# EAGLE design Mabee_Serial WiFi V1.1 (EAGLE 6.1)
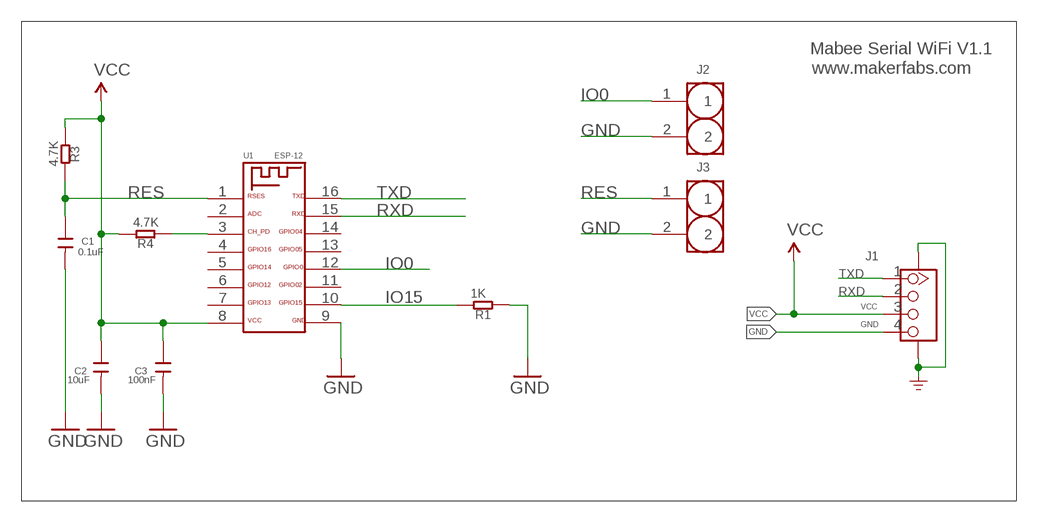
[diagram p0: schematic, sheet 1]

## Parts
C1  0.1uF  C-0603  [C0603]
C2  10uF  C-0603  [C0603]
C3  100nF  C-0603  [C0603]
J1  GROVE-CONNECTOR-SMD'90D'  [HW4-SMD-2.0-90D]
J2  HEADER-2P-65/35MIL  [2P-2.54-65/35MIL]
J3  HEADER-2P-65/35MIL  [2P-2.54-65/35MIL]
R1  1K  R-0603  [0603]
R3  4.7K  R-0603  [0603]
R4  4.7K  R-0603  [0603]
U1  ESP-12  [ESP-12]

## Nets
EN: R4.1 U1.3
GND: C1.2 C2.2 C3.2 J1.4 J1.SS1 J1.SS2 J2.2 J3.2 R1.1 U1.9
IO0: J2.1 U1.12
IO15: R1.2 U1.10
RES: C1.1 J3.1 R3.2 U1.1
RXD: J1.2 U1.15
TXD: J1.1 U1.16
VCC: C2.1 C3.1 J1.3 R3.1 R4.2 U1.8
Unconnected: U1.2 U1.4 U1.5 U1.6 U1.7 U1.11 U1.13 U1.14

## Notes on the sheet
- Mabee Serial WiFi V1.1
- www.makerfabs.com

## Library data of the parts
C1-C3 = Discrete:C*: Ceramic Capacitors
J1 = Connector-new:GROVE-CONNECTOR-SMD: 4P-SMD-2.0:320110030;4P-SMD-2.0-90D:320110032
J2 J3 = Connector:HEADER-2P
R1 R3 R4 = Discrete:R*
U1 = Discrete:ESP-12

## Net classes
0 default: width 0.203 mm, drill 0.305 mm, clearance 0.152 mm
1 vbat: width 0.254 mm, drill 0.305 mm, clearance 0.152 mm

## Board
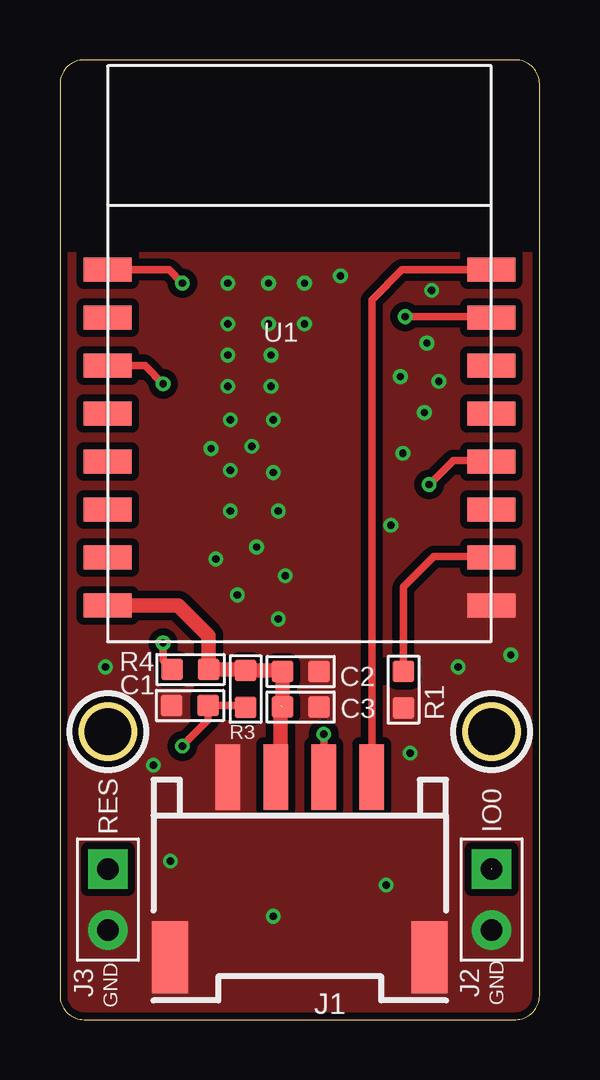
[diagram p1: board, top side]
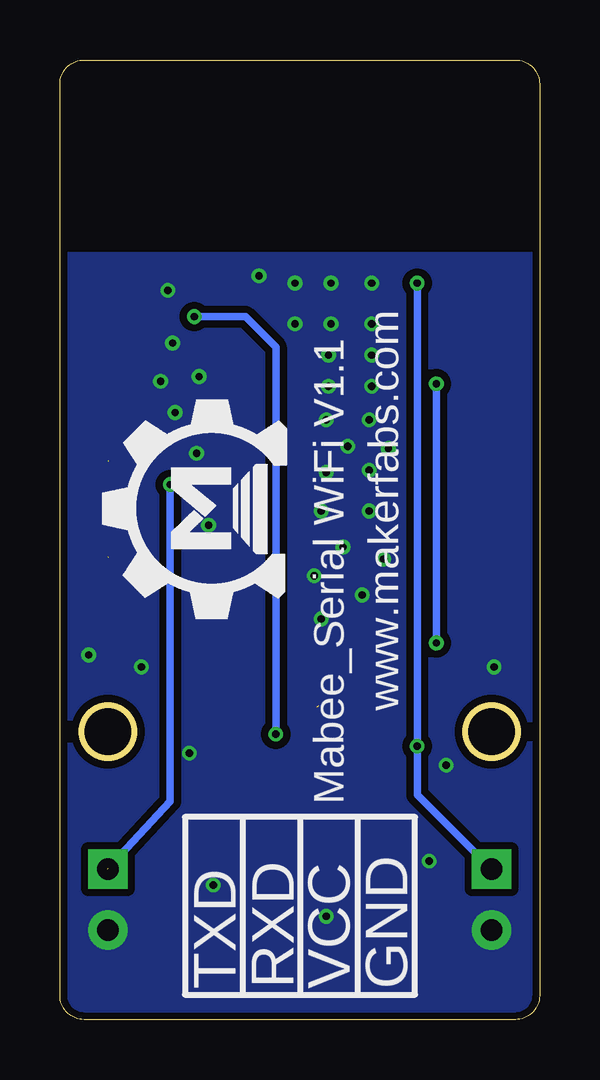
[diagram p2: board, bottom side, seen from below]

Size 20 x 40 mm. Coordinates in mm from the lower left corner, seen from the top.
Outline: 19,40 1,40 arc90 0,39 0,1 arc90 1,0 19,0 arc90 20,1 20,39 arc90 19,40
Outline: circle at 2,12 radius 1.1
Outline: circle at 18,12 radius 1.1
Copper layers (1*16): Top 0.035mm / dielectric 1.5mm / Bottom 0.035mm
Design rules: minimum track width 6mil, minimum drill 12mil, track to track 6mil, track to pad 6mil, pad to pad 6mil, via to via 6mil, smd to smd 0mil, copper to edge 10mil, drill to drill 10mil, minimum pad ring 10mil, minimum via ring 6mil, stop-mask expansion 2mil, vias tented up to drill 100mil, thermal gap 0mil
tRestrict: area -1.2,32.3 to 23,40.4
bRestrict: area -1.2,32.3 to 23,40.4

### Footprints (pad centres in the part's own frame; a part is rotated, then mirrored left to right if it is on the bottom)
C0603 = smd 0.889 x 0.889: 1 -0.762,0; 2 0.762,0
HW4-SMD-2.0-90D = smd 1.01 x 2.74: 1 -3,-0.1; 2 -1,-0.1; 3 1,-0.1; 4 3,-0.1 | smd 1.5 x 3: SS1 -5.4,7.4; SS2 5.4,7.4
2P-2.54-65/35MIL = drill 0.889 pad 1.651 square: 1 0,1.27 | drill 0.889 pad 1.651: 2 0,-1.27
0603 = smd 0.889 x 0.889: 1 -0.762,0; 2 0.762,0
ESP-12 = smd 2 x 1: 1 0,15.5; 2 0,13.5; 3 0,11.5; 4 0,9.5; 5 0,7.5; 6 0,5.5; 7 0,3.5; 8 0,1.5; 9 16,1.5; 10 16,3.5; 11 16,5.5; 12 16,7.5; 13 16,9.5; 14 16,11.5; 15 16,13.5; 16 16,15.5

### Placement (x,y rotation side)
C1  5.42,13.09 180 top
C2  10.04,14.51 0 top
C3  10.04,13.03 0 top
J1  10,10 180 top
J2  18,5 0 top
J3  2,5 0 top
R1  14.33,13.75 90 top
R3  7.74,13.78 270 top
R4  5.44,14.59 0 top
U1  1.99,15.76 0 top
U$2  [MAKERFABS_0.3]  10.61,17.18 90 bottom

### Tracks (layer width: path | path; a pad name or v marks a point on that pad's centre or on a via)
EN  (via drill 0.3)  (1 unrouted)
  Top 0.305: v4.3,26.5 3.54,27.26 U1.3 | R4.1 4.3,14.97 v4.3,15.7
  Bottom 0.305: v4.3,15.7 v4.3,26.5
GND  (via drill 0.3)
  other vias: 9.1,21.2 7.1,25 7,30.7 8.7,30.7 6.3,23.8 15.3,28.2 15.2,25.3 14.3,23.6 13.8,20.6 15.8,26.6 8,23.9 8.9,22.8 7.1,22.9 7,26.4 8.9,25 7,27.7 8.8,27.7 8.8,26.4 7,29 8.7,29 10.2,29 10.2,30.7 6.5,19.2 8.2,19.7 7.4,17.7 9.4,18.5 9.1,16.7 7.1,21.2 15.5,30.4 3.9,10.6 11.7,31 14.6,11.1 4.6,6.6 14.2,26.8 18.8,15.2 16.6,14.7 1.9,14.7 8.9,4.3 13.6,5.6
  pour Top (isolate 0.305, no thermals): -2.6,30.8 -2.6,40.73 -1.33,42 9.3,42 21.63,42 22.9,40.73 22.9,26.4 22.9,-2.23 21.63,-3.5 10.1,-3.5 -1.33,-3.5 -2.6,-2.23
  pour Bottom (isolate 0.305, no thermals): -2.2,30.3 -2.2,40.23 -0.93,41.5 6.6,41.5 20.83,41.5 22.1,40.23 22.1,30.6 22.1,-1.63 20.83,-2.9 9.1,-2.9 -0.93,-2.9 -2.2,-1.63
IO0  (via drill 0.3)  (2 unrouted)
  Top 0.305: v15.4,22.3 16.4,23.3 18,23.3
  Bottom 0.305: v15.4,22.3 15.4,9.1 18,6.3
IO15  (1 unrouted)
  Top 0.305: R1.2 14.33,18.03 15.6,19.3 18,19.3
RES  (via drill 0.3)  (1 unrouted)
  Top 0.305: 7.67,13.09 C1.1 6.18,12.48 v5.1,11.4 | v5.1,30.7 4.54,31.26 U1.1
  Top 0.61: R3.2 7.67,13.09
  Bottom 0.305: v5.1,30.7 v5.1,11.4 5.1,10 5.1,9.97 5.1,9.37 J3.1
RXD  (via drill 0.3)
  Top 0.305: U1.15 17.95,29.3 v14.4,29.3 | v11,11.9 J1.2
  Bottom 0.305: v14.4,29.3 12.27,29.3 11,28.03 v11,11.9
TXD
  Top 0.305: J1.1 13,29.99 14.27,31.26 U1.16
VCC  (1 unrouted)
  Top 0.61: J1.3 9.2,10.3 9.2,13.1 | C3.1 C2.1 9.24,14.54 R3.1 7.69,14.59 R4.2 6.2,15.99 4.93,17.26 U1.8

### Text on the board
tPlace: RES | IO0 | GND | GND
bNames: www.makerfabs.com | Mabee_Serial WiFi V1.1 | GND | VCC | RXD | TXD